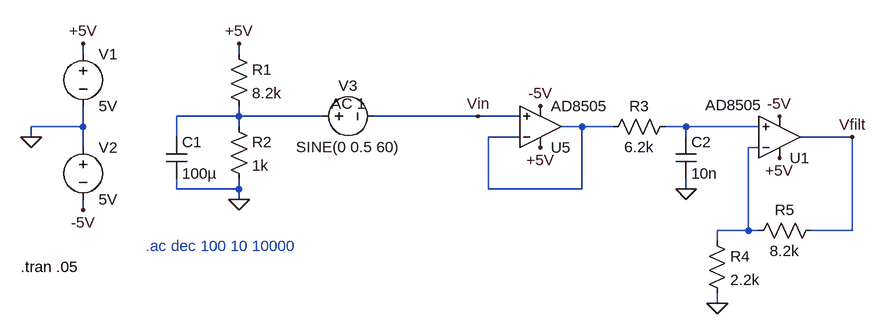
[diagram p0: schematic Av1b.asc]
Av1b.asc, the LTspice schematic file:
Version 4
SHEET 1 1632 680
WIRE -384 -224 -384 -240
WIRE -144 -224 -144 -240
WIRE -144 -128 -144 -144
WIRE -144 -128 -240 -128
WIRE -16 -128 -144 -128
WIRE 224 -128 64 -128
WIRE 288 -128 224 -128
WIRE -384 -112 -384 -144
WIRE -384 -112 -464 -112
WIRE -144 -112 -144 -128
WIRE 384 -112 352 -112
WIRE 432 -112 384 -112
WIRE 544 -112 512 -112
WIRE 656 -112 544 -112
WIRE -464 -96 -464 -112
WIRE -240 -96 -240 -128
WIRE 288 -96 240 -96
WIRE 544 -96 544 -112
WIRE 800 -96 720 -96
WIRE -384 -80 -384 -112
WIRE 656 -80 640 -80
WIRE -240 -16 -240 -32
WIRE -144 -16 -144 -32
WIRE -144 -16 -240 -16
WIRE 240 -16 240 -96
WIRE 384 -16 384 -112
WIRE 384 -16 240 -16
WIRE 544 -16 544 -32
WIRE -144 0 -144 -16
WIRE -384 16 -384 0
WIRE 640 48 640 -80
WIRE 640 48 592 48
WIRE 656 48 640 48
WIRE 800 48 800 -96
WIRE 800 48 736 48
WIRE 592 64 592 48
WIRE 592 160 592 144
FLAG -464 -96 0
FLAG -384 -240 +5V
FLAG -384 16 -5V
FLAG -144 0 0
FLAG -144 -240 +5V
FLAG 544 -16 0
FLAG 592 160 0
FLAG 688 -128 -5V
FLAG 688 -64 +5V
FLAG 800 -96 Vfilt
FLAG 320 -144 -5V
FLAG 320 -80 +5V
FLAG 224 -128 Vin
SYMBOL voltage -384 -240 R0
WINDOW 123 0 0 Left 0
WINDOW 39 0 0 Left 0
SYMATTR InstName V1
SYMATTR Value 5V
SYMBOL voltage -384 -96 R0
WINDOW 123 0 0 Left 0
WINDOW 39 0 0 Left 0
SYMATTR InstName V2
SYMATTR Value 5V
SYMBOL res -160 -240 R0
SYMATTR InstName R1
SYMATTR Value 8.2k
SYMBOL res -160 -128 R0
SYMATTR InstName R2
SYMATTR Value 1k
SYMBOL cap -256 -96 R0
SYMATTR InstName C1
SYMATTR Value 100µ
SYMBOL voltage -32 -128 R270
WINDOW 0 32 56 VTop 2
WINDOW 3 -32 56 VBottom 2
WINDOW 123 4 56 VTop 2
WINDOW 39 0 0 Left 0
SYMATTR InstName V3
SYMATTR Value SINE(0 0.5 60)
SYMATTR Value2 AC 1
SYMBOL OpAmps\\AD8505 688 -32 M180
WINDOW 3 -114 113 Left 2
SYMATTR InstName U1
SYMBOL res 528 -128 R90
WINDOW 0 0 56 VBottom 2
WINDOW 3 32 56 VTop 2
SYMATTR InstName R3
SYMATTR Value 6.2k
SYMBOL cap 528 -96 R0
SYMATTR InstName C2
SYMATTR Value 10n
SYMBOL res 752 32 R90
WINDOW 0 0 56 VBottom 2
WINDOW 3 32 56 VTop 2
SYMATTR InstName R5
SYMATTR Value 8.2k
SYMBOL res 576 48 R0
SYMATTR InstName R4
SYMATTR Value 2.2k
SYMBOL OpAmps\\AD8505 320 -48 M180
SYMATTR InstName U5
TEXT -480 104 Left 2 !.tran .05
TEXT -288 72 Left 2 ;.ac dec 100 10 10000

The netlist it stands for:
* Av1b.asc
V1 +5V 0 5V
V2 0 -5V 5V
R1 +5V N001 8.2k
R2 N001 0 1k
C1 N001 0 100µ
V3 N001 Vin SINE(0 0.5 60) AC 1
XU1 N003 N004 +5V -5V Vfilt AD8505  ; pins In+ In- V+ V- OUT
R3 N003 N002 6.2k
C2 N003 0 10n
R5 Vfilt N004 8.2k
R4 N004 0 2.2k
XU5 Vin N002 +5V -5V N002 AD8505  ; pins In+ In- V+ V- OUT
.tran .05
* .ac dec 100 10 10000
.backanno
.end